# Altium schematic sheet AFE_Main.SchDoc
size A4; SheetNumber: 1; SheetTotal: 3
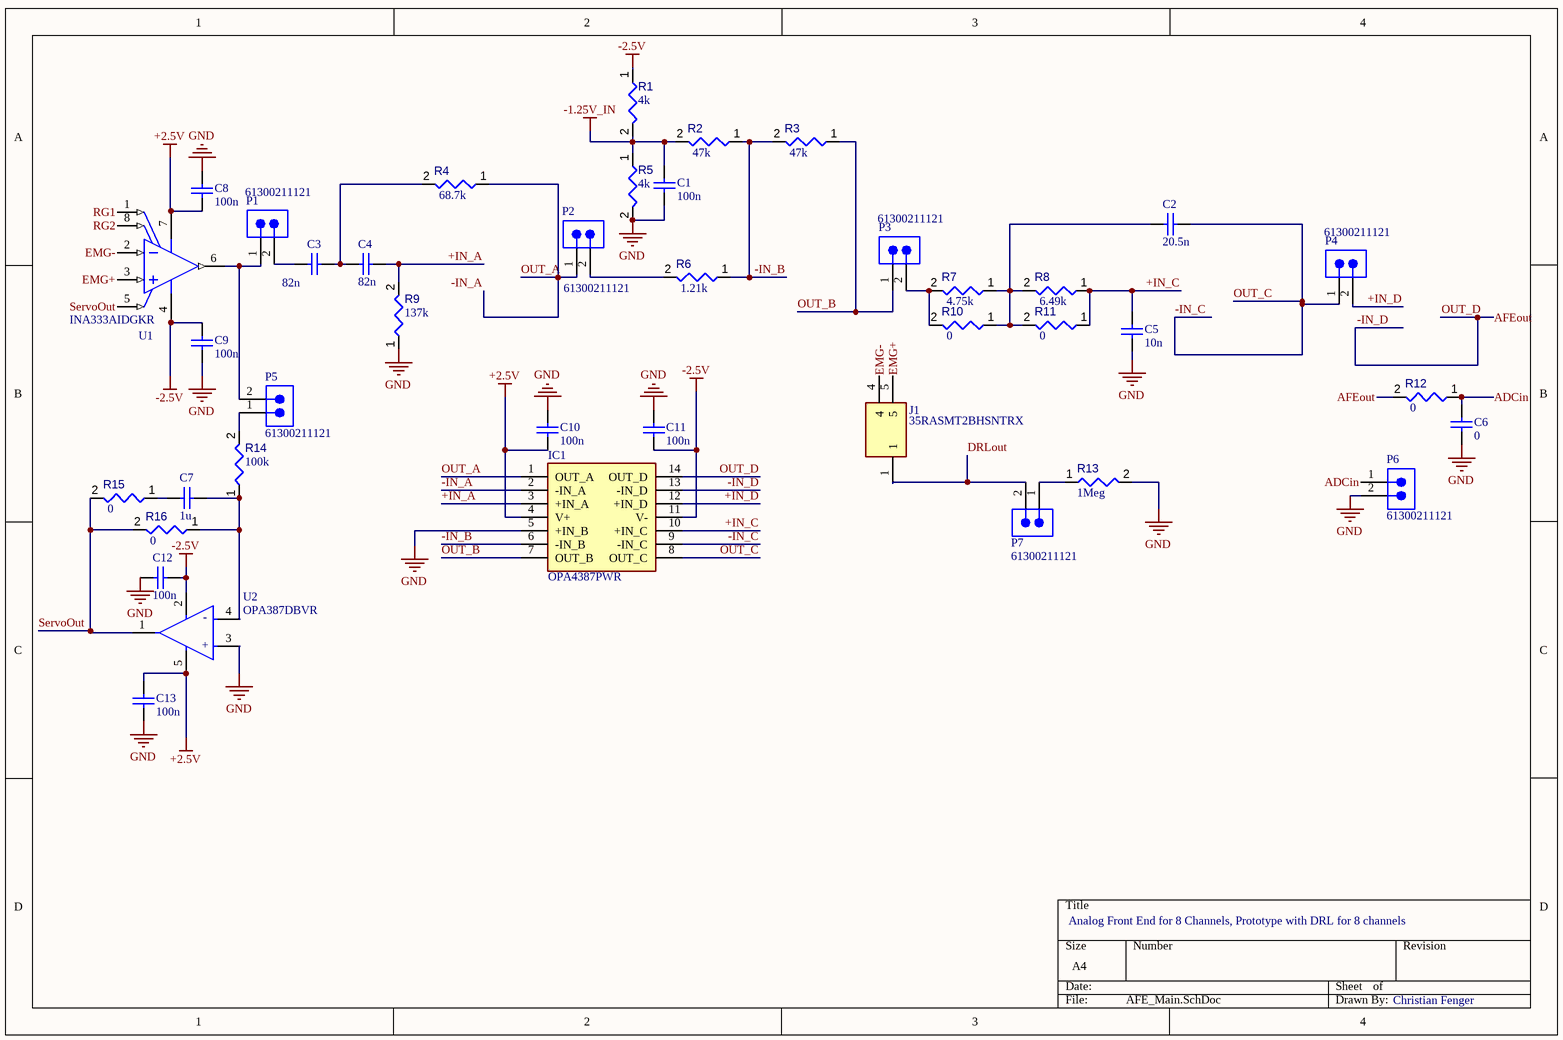
[diagram p0: AFE_Main.SchDoc]

## Parts
C1  100n  [WCAP-CSGP_0402_L1W0.5H0.5]
C2  20.5n  [WCAP-CSGP_0402_L1W0.5H0.5]
C3  82n  [WCAP-CSGP_0402_L1W0.5H0.5]
C4  82n  [WCAP-CSGP_0402_L1W0.5H0.5]
C5  10n  [WCAP-CSGP_0402_L1W0.5H0.5]
C6  0  [WCAP-CSGP_0402_L1W0.5H0.5]
C7  1u  [WCAP-CSGP_0402_L1W0.5H0.5]
C8  100n  [WCAP-CSGP_0402_L1W0.5H0.5]
C9  100n  [WCAP-CSGP_0402_L1W0.5H0.5]
C10  100n  [WCAP-CSGP_0402_L1W0.5H0.5]
C11  100n  [WCAP-CSGP_0402_L1W0.5H0.5]
C12  100n  [WCAP-CSGP_0402_L1W0.5H0.5]
C13  100n  [WCAP-CSGP_0402_L1W0.5H0.5]
IC1  OPA4387PWR  [SOP65P640X120-14N]
J1  35RASMT2BHSNTRX  [35RASMT2BHSNTRX]
P1  61300211121  [61300211121]
P2  61300211121  [61300211121]
P3  61300211121  [61300211121]
P4  61300211121  [61300211121]
P5  61300211121  [61300211121]
P6  61300211121  [61300211121]
P7  61300211121  [61300211121]
R1  value 4k  [RESC1005X40X25ML05T05]  (hidden comment: Resistor 4k7 +/-1% 0402 63 mW)
R2  value 47k  [RESC1005X40X25ML05T05]  (hidden comment: Resistor 4k7 +/-1% 0402 63 mW)
R3  value 47k  [RESC1005X40X25ML05T05]  (hidden comment: Resistor 4k7 +/-1% 0402 63 mW)
R4  value 68.7k  [RESC1005X40X25ML05T05]  (hidden comment: Resistor 4k7 +/-1% 0402 63 mW)
R5  value 4k  [RESC1005X40X25ML05T05]  (hidden comment: Resistor 4k7 +/-1% 0402 63 mW)
R6  value 1.21k  [RESC1005X40X25ML05T05]  (hidden comment: Resistor 4k7 +/-1% 0402 63 mW)
R7  value 4.75k  [RESC1005X40X25ML05T05]  (hidden comment: Resistor 4k7 +/-1% 0402 63 mW)
R8  value 6.49k  [RESC1005X40X25ML05T05]  (hidden comment: Resistor 4k7 +/-1% 0402 63 mW)
R9  value 137k  [RESC1005X40X25ML05T05]  (hidden comment: Resistor 4k7 +/-1% 0402 63 mW)
R10  value 0  [RESC1005X40X25ML05T05]  (hidden comment: Resistor 4k7 +/-1% 0402 63 mW)
R11  value 0  [RESC1005X40X25ML05T05]  (hidden comment: Resistor 4k7 +/-1% 0402 63 mW)
R12  value 0  [RESC1005X40X25ML05T05]  (hidden comment: Resistor 4k7 +/-1% 0402 63 mW)
R13  value 1Meg  [RESC1005X40X25ML05T05]  (hidden comment: Resistor 4k7 +/-1% 0402 63 mW)
R14  value 100k  [RESC1005X40X25ML05T05]  (hidden comment: Resistor 4k7 +/-1% 0402 63 mW)
R15  value 0  [RESC1005X40X25ML05T05]  (hidden comment: Resistor 4k7 +/-1% 0402 63 mW)
R16  value 0  [RESC1005X40X25ML05T05]  (hidden comment: Resistor 4k7 +/-1% 0402 63 mW)
U1  INA333AIDGKR  [DGK0008A_N]
U2  OPA387DBVR  [FP-DBV0005A-MFG]

## Nets
+2.5V: C8.1 C10.1 C13.2 IC1.4(V+) U1.7(V+) U2.5(V+)
-1.25V_IN: C1.2 R1.2 R2.2 R5.1
-2.5V: C9.2 C11.1 C12.1 IC1.11(V-) R1.1 U1.4(V-) U2.2(V-)
GND: C1.1 C5.2 C6.1 C8.2 C9.1 C10.2 C11.2 C12.2 C13.1 IC1.5(+IN_B) P6.2 R5.2 R9.1 R13.2 U2.3(+IN)
+IN_A: C4.2 IC1.3(+IN_A) R9.2
+IN_C: C5.1 IC1.10(+IN_C) R8.1 R11.1
+IN_D: IC1.12(+IN_D) P4.2
-IN_A: IC1.1(OUT_A) IC1.2(-IN_A) P2.1 R4.1  [also labelled OUT_A]
-IN_B: IC1.6(-IN_B) R2.1 R3.2 R6.1
-IN_C: C2.2 IC1.8(OUT_C) IC1.9(-IN_C) P4.1  [also labelled OUT_C]
-IN_D: IC1.13(-IN_D) IC1.14(OUT_D) R12.2  [also labelled AFEout, OUT_D]
ADCin: C6.2 P6.1 R12.1
DRLout: J1.1 P7.2
EMG+: J1.5 U1.3(VIN+)
EMG-: J1.4 U1.2(VIN-)
OUT_B: IC1.7(OUT_B) P3.1 R3.1
RG1: U1.1(RG)
RG2: U1.8(RG)
ServoOut: R15.2 R16.2 U1.5(REF) U2.1(OUT)
NetC2_1: C2.1 R7.1 R8.2 R10.1 R11.2
NetC3_1: C3.1 P1.2
NetC3_2: C3.2 C4.1 R4.2
NetC7_1: C7.1 R15.1
NetC7_2: C7.2 R14.1 R16.1 U2.4(-IN)
NetP1_1: P1.1 P5.2 U1.6(VOUT)
NetP2_2: P2.2 R6.2
NetP3_2: P3.2 R7.2 R10.2
NetP5_1: P5.1 R14.2
NetP7_1: P7.1 R13.1

## Notes on the sheet
- Analog Front End for 8 Channels, Prototype with DRL for 8 channels
- Christian Fenger
- (in symbol CMP-00370-122620778-1) -; +

## Library data of the parts
C1-C13 = CMP-207839-000017-2: CAP CER 10000PF 50V X7R 0402; NexarPartId: 53703204; Insulation Resistance: 10GΩ; Material: Ceramic; Tolerance: 10%; Capacitance: 10nF; Packaging: Tape & Reel (TR); Voltage Rating: 50V; Thickness: 558.8µm; Case Code (Imperial): 0402; Dielectric: X7R; Mount: Surface Mount; Width: 500µm; Height: 500µm; Min Operating Temperature: -55°C; Case/Package: 0402; RoHS: Compliant; Case Code (Metric): 1005; REACH SVHC: Unknown; Max Operating Temperature: 125°C; Voltage Rating (DC): 50V; Length: 1mm
IC1 = OPA4387PWR: Integrated Circuit; Manufacturer_Name: Texas Instruments; Datasheet Link: https://www.ti.com/lit/ds/symlink/opa4387.pdf?ts=1647260978388&ref_url=https%253A%252F%252Fwww.ti.com%252Fproduct%252FOPA4387%253FkeyMatch%253DOPA4387PWT%2526tisearch%253Dsearch-everything%2526usecase%253DOPN; Height: 1.2mm; Manufacturer_Part_Number: OPA4387PWR; Mouser Part Number: 595-OPA4387PWR; Mouser Price/Stock: https://www.mouser.co.uk/ProductDetail/Texas-Instruments/OPA4387PWR?qs=doiCPypUmgHWEYR9FZXdjQ%3D%3D; Arrow Part Number: OPA4387PWR; Arrow Price/Stock: https://www.arrow.com/en/products/opa4387pwr/texas-instruments?region=nac
J1 = 35RASMT2BHSNTRX: Connector; Manufacturer_Name: Switchcraft; Datasheet Link: https://www.switchcraft.com/assets/1/24/35RASMT2BHSNTRX_CD.pdf; Height: 5.1mm; Manufacturer_Part_Number: 35RASMT2BHSNTRX; Mouser Part Number: 502-35RASMT2BHSNTRX; Mouser Price/Stock: https://www.mouser.co.uk/ProductDetail/Switchcraft/35RASMT2BHSNTRX?qs=Li%252BoUPsLEnu6MywKCFGumw%3D%3D
P1-P7 = CMP-1712-00002-6: NexarPartId: 20081794; Number of Contacts: 2; Pitch: 2.54mm; Connector Type: Male Pin; Voltage Rating: 250V; Current Rating: 3A; Gender: Male; Contact Resistance: 20mΩ; Height: 8.94mm; Lead Free: Lead Free; Number of Pins: 2; Termination: Through Hole; RoHS: Compliant; Lead Pitch: 2.54mm; REACH SVHC: No SVHC; Housing Material: PBT; Contact Mating Length: 5.9944mm; Min Operating Temperature: -40°C; Orientation: Vertical; Contact Material: Copper; Contact Gender: Male; Max Operating Temperature: 125°C; Number of Rows: 1; Number of Positions: 2; Packaging: Bulk; Contact Plating: Gold; Mount: Through Hole; Color: Black; Operating Supply Voltage: 250V
R1-R16 = CMP-009-00034-5: Chip Resistor, 4.7 KOhm, +/- 1%, 63 mW, -55 to 155 degC, 0402 (1005 Metric); Power: 63mW; Voltage Rating: 50V; Case/Package: 0402; Tolerance: 1%; Max Operating Temperature: 155°C; Pins: 2; RoHS Compliant: True; Min Operating Temperature: -55°C; Mounting Technology: SM
U1 = CMP-0944-00088-2: Low Power, Precision Instrumentation Amplifier, -40 to 125 degC, 8-pin SOP (DGK8), Green (RoHS & no Sb/Br); Manufacturer: Texas Instruments; Input Offset Drift (+/-)(Max)(uV/Degrees Celsius): 0.1; Vs(Max)(V): 5.5; Input Bias Current (+/-)(Max)(nA): 0.2; Output Offset (+/-)(Max)(uV): 75/G; CMRR(Min)(dB): 100; Noise at 1kHz(Typ)(nV/rt(Hz)): 50; Output Offset Drift (+/-)(Max)(uV/Degrees Celsius): 0.5/G; Vs(Min)(V): 1.8; Quiescent Current (+/-)(Typ)(mA): 0.05; Gain(V/V): 1 to 1000; SubFamily: Single Supply; Number of Channels: 1; Input Offset (+/-)(Max)(uV): 25; Code_JEDEC: MO-187; Eco-Plan: Green (RoHS & no Sb/Br); ComponentLink2URL: http://www.ti.com/general/docs/lit/getliterature.tsp?genericPartNumber=INA333&fileType=pdf; Mounting Technology: Surface Mount; PartNumber: INA333AIDGKR; ComponentLink3URL: http://www.ti.com/litv/pdf/mpds028d; ComponentLink1URL: http://www.ti.com/; DatasheetVersion: SBOS445B; ComponentLink2Description: Datasheet; PackageVersion: 4073329/E, 05/2006; PackageReference: DGK0008A; ComponentLink3Description: Package Specification; PackageDescription: 8-Pin Thin Small Outline, Body 3 x 3 mm, Pitch 0.65 mm; ComponentLink1Description: Manufacturer URL
U2 = CMP-00370-122620778-1: OPA387DBVR Ultra-high precision (2 µV), zero-drift (0.003 µV/C), low-input-bias-current op amp (single) 5-SOT-23 -40 to 125; Manufacturer Lifecycle Status: ACTIVE; Output Current per Channel: 55mA; Max Junction Temperature (Tj): 150°C; Input Offset Voltage (Vos): 250nV; Max Supply Voltage: 5.5V; Nominal Supply Current: 570µA; Min Supply Voltage: 1.7V; Voltage Gain: 145dB; Min Dual Supply Voltage: 850mV; Input Bias Current: 30pA; Response Time: 5.5µs; Number of Channels: 1; Max Dual Supply Voltage: 2.75V; Ambient Temperature Range High: 125°C; Height: 1.45mm; Width: 1.6mm; Min Operating Temperature: -40°C; Max Operating Temperature: 125°C; Thickness: 1.2mm; Number of Pins: 5; Length: 2.9mm; Lifecycle Status: Production; Case/Package: SOT-23; NexarPartId: 122620778